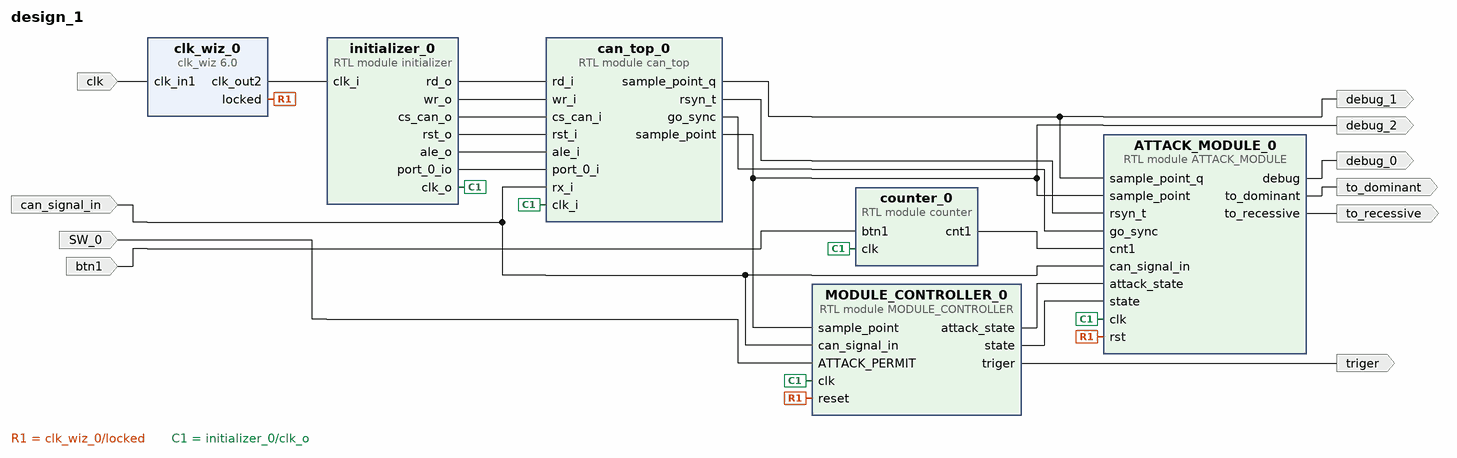
[diagram p0: block diagram of the top level]
# Vivado block design design_1, xc7a35ticsg324-1L, Vivado 2018.3
create_bd_design design_1

create_bd_port -dir I -type clk clk
set_property -dict {CONFIG.FREQ_HZ 100000000} [get_bd_ports clk]
create_bd_port -dir I can_signal_in
create_bd_port -dir O to_dominant
create_bd_port -dir O triger
create_bd_port -dir O debug_0
create_bd_port -dir O debug_1
create_bd_port -dir O debug_2
create_bd_port -dir O to_recessive
create_bd_port -dir I SW_0
create_bd_port -dir I btn1

create_bd_cell -type ip -vlnv xilinx.com:ip:clk_wiz:6.0 clk_wiz_0
set_property -dict [list \
  CONFIG.CLKIN2_JITTER_PS 166.66 \
  CONFIG.CLKOUT1_JITTER 346.176 \
  CONFIG.CLKOUT1_PHASE_ERROR 301.601 \
  CONFIG.CLKOUT1_REQUESTED_OUT_FREQ 16 \
  CONFIG.CLKOUT2_JITTER 302.524 \
  CONFIG.CLKOUT2_PHASE_ERROR 301.601 \
  CONFIG.CLKOUT2_REQUESTED_OUT_FREQ 32 \
  CONFIG.CLKOUT2_USED true \
  CONFIG.CLKOUT3_JITTER 290.458 \
  CONFIG.CLKOUT3_PHASE_ERROR 301.601 \
  CONFIG.CLKOUT3_REQUESTED_OUT_FREQ 40 \
  CONFIG.CLKOUT3_USED true \
  CONFIG.MMCM_CLKFBOUT_MULT_F 48.000 \
  CONFIG.MMCM_CLKIN2_PERIOD 10.000 \
  CONFIG.MMCM_CLKOUT0_DIVIDE_F 60.000 \
  CONFIG.MMCM_CLKOUT1_DIVIDE 30 \
  CONFIG.MMCM_CLKOUT2_DIVIDE 24 \
  CONFIG.MMCM_DIVCLK_DIVIDE 5 \
  CONFIG.NUM_OUT_CLKS 3 \
  CONFIG.SECONDARY_SOURCE Single_ended_clock_capable_pin \
  CONFIG.USE_INCLK_SWITCHOVER false \
  CONFIG.USE_LOCKED true \
  CONFIG.USE_RESET false \
] [get_bd_cells clk_wiz_0]
create_bd_cell -type module -reference initializer initializer_0
create_bd_cell -type module -reference counter counter_0
create_bd_cell -type module -reference can_top can_top_0
create_bd_cell -type module -reference MODULE_CONTROLLER MODULE_CONTROLLER_0
create_bd_cell -type module -reference ATTACK_MODULE ATTACK_MODULE_0

# ---- connections ----

connect_bd_net -net initializer_0_rd_i [get_bd_pins initializer_0/rd_o] [get_bd_pins can_top_0/rd_i]
connect_bd_net [get_bd_ports clk] [get_bd_pins clk_wiz_0/clk_in1]
connect_bd_net [get_bd_pins MODULE_CONTROLLER_0/triger] [get_bd_ports triger]
connect_bd_net [get_bd_pins clk_wiz_0/locked] [get_bd_pins MODULE_CONTROLLER_0/reset] [get_bd_pins ATTACK_MODULE_0/rst]
connect_bd_net [get_bd_pins initializer_0/clk_o] \
  [get_bd_pins counter_0/clk] [get_bd_pins can_top_0/clk_i] [get_bd_pins MODULE_CONTROLLER_0/clk] \
  [get_bd_pins ATTACK_MODULE_0/clk]
connect_bd_net [get_bd_ports can_signal_in] \
  [get_bd_pins can_top_0/rx_i] [get_bd_pins MODULE_CONTROLLER_0/can_signal_in] [get_bd_pins ATTACK_MODULE_0/can_signal_in]
connect_bd_net [get_bd_pins clk_wiz_0/clk_out2] [get_bd_pins initializer_0/clk_i]
connect_bd_net [get_bd_pins initializer_0/wr_o] [get_bd_pins can_top_0/wr_i]
connect_bd_net [get_bd_pins initializer_0/cs_can_o] [get_bd_pins can_top_0/cs_can_i]
connect_bd_net [get_bd_pins initializer_0/rst_o] [get_bd_pins can_top_0/rst_i]
connect_bd_net [get_bd_pins initializer_0/ale_o] [get_bd_pins can_top_0/ale_i]
connect_bd_net [get_bd_pins initializer_0/port_0_io] [get_bd_pins can_top_0/port_0_i]
connect_bd_net [get_bd_pins can_top_0/sample_point_q] [get_bd_ports debug_1] [get_bd_pins ATTACK_MODULE_0/sample_point_q]
connect_bd_net [get_bd_pins can_top_0/sample_point] \
  [get_bd_ports debug_2] [get_bd_pins MODULE_CONTROLLER_0/sample_point] [get_bd_pins ATTACK_MODULE_0/sample_point]
connect_bd_net [get_bd_pins MODULE_CONTROLLER_0/attack_state] [get_bd_pins ATTACK_MODULE_0/attack_state]
connect_bd_net [get_bd_pins MODULE_CONTROLLER_0/state] [get_bd_pins ATTACK_MODULE_0/state]
connect_bd_net [get_bd_pins ATTACK_MODULE_0/to_dominant] [get_bd_ports to_dominant]
connect_bd_net [get_bd_pins ATTACK_MODULE_0/to_recessive] [get_bd_ports to_recessive]
connect_bd_net [get_bd_pins can_top_0/rsyn_t] [get_bd_pins ATTACK_MODULE_0/rsyn_t]
connect_bd_net [get_bd_pins ATTACK_MODULE_0/debug] [get_bd_ports debug_0]
connect_bd_net [get_bd_pins can_top_0/go_sync] [get_bd_pins ATTACK_MODULE_0/go_sync]
connect_bd_net -net SW_0_1 [get_bd_ports SW_0] [get_bd_pins MODULE_CONTROLLER_0/ATTACK_PERMIT]
connect_bd_net -net btn1_1 [get_bd_ports btn1] [get_bd_pins counter_0/btn1]
connect_bd_net [get_bd_pins counter_0/cnt1] [get_bd_pins ATTACK_MODULE_0/cnt1]

validate_bd_design
save_bd_design
